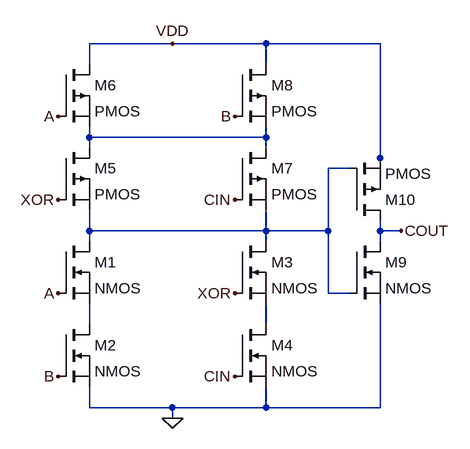
[diagram p0: schematic cout.asc]
cout.asc, the LTspice schematic file:
Version 4
SHEET 1 880 680
WIRE 272 -208 144 -208
WIRE 416 -208 272 -208
WIRE 592 -208 416 -208
WIRE 144 -176 144 -208
WIRE 416 -176 416 -208
WIRE 144 -64 144 -80
WIRE 416 -64 416 -80
WIRE 416 -64 144 -64
WIRE 144 -48 144 -64
WIRE 416 -48 416 -64
WIRE 592 -32 592 -208
WIRE 544 -16 512 -16
WIRE 592 -16 592 -32
WIRE 144 80 144 48
WIRE 416 80 416 48
WIRE 416 80 144 80
WIRE 512 80 512 -16
WIRE 512 80 416 80
WIRE 592 80 592 64
WIRE 624 80 592 80
WIRE 144 96 144 80
WIRE 416 96 416 80
WIRE 592 96 592 80
WIRE 512 176 512 80
WIRE 544 176 512 176
WIRE 144 224 144 192
WIRE 416 224 416 192
WIRE 144 352 144 320
WIRE 272 352 144 352
WIRE 416 352 416 320
WIRE 416 352 272 352
WIRE 592 352 592 192
WIRE 592 352 416 352
WIRE 272 368 272 352
FLAG 272 368 0
FLAG 272 -208 VDD
FLAG 96 176 A
FLAG 96 304 B
FLAG 368 176 XOR
FLAG 368 304 CIN
FLAG 96 -96 A
FLAG 368 -96 B
FLAG 96 32 XOR
FLAG 368 32 CIN
FLAG 624 80 COUT
SYMBOL nmos 96 96 R0
SYMATTR InstName M1
SYMBOL nmos 96 224 R0
SYMATTR InstName M2
SYMBOL nmos 368 96 R0
SYMATTR InstName M3
SYMBOL nmos 368 224 R0
SYMATTR InstName M4
SYMBOL pmos 96 -48 R0
SYMATTR InstName M5
SYMBOL pmos 96 -176 R0
SYMATTR InstName M6
SYMBOL pmos 368 -48 R0
SYMATTR InstName M7
SYMBOL pmos 368 -176 R0
SYMATTR InstName M8
SYMBOL nmos 544 96 R0
SYMATTR InstName M9
SYMBOL pmos 544 64 M180
SYMATTR InstName M10

The netlist it stands for:
* cout.asc
M1 N002 A N003 N003 NMOS
M2 N003 B 0 0 NMOS
M3 N002 XOR N004 N004 NMOS
M4 N004 CIN 0 0 NMOS
M5 N001 XOR N002 N002 PMOS
M6 VDD A N001 N001 PMOS
M7 N001 CIN N002 N002 PMOS
M8 VDD B N001 N001 PMOS
M9 COUT N002 0 0 NMOS
M10 COUT N002 VDD VDD PMOS
.model NMOS NMOS
.model PMOS PMOS
.lib standard.mos
.backanno
.end